# EAGLE design v1 (EAGLE 7.6.0)
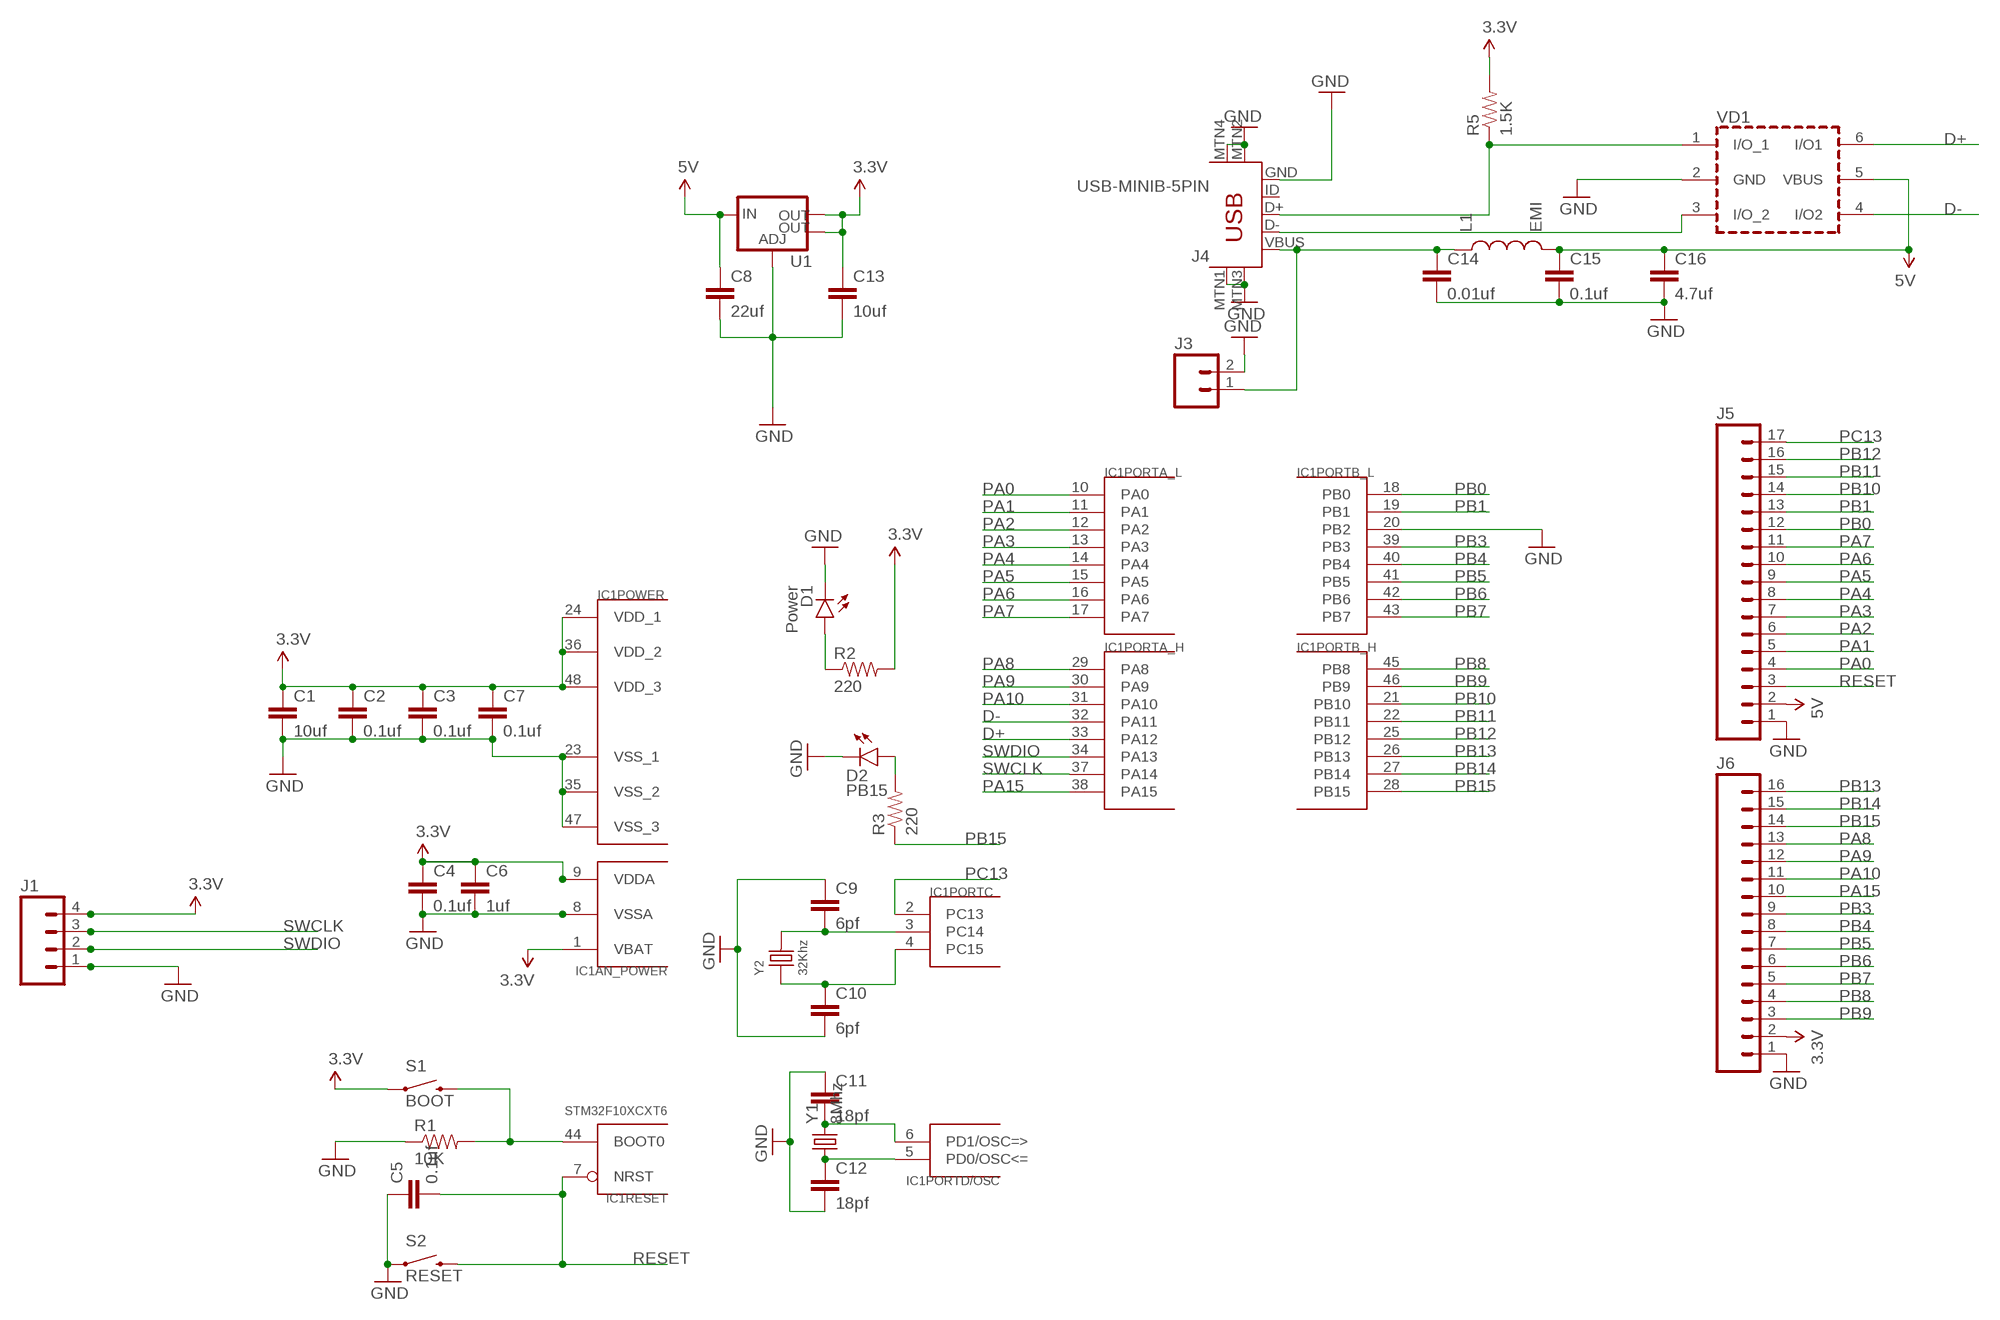
[diagram p0: schematic, sheet 1]

## Parts
C1  10uf  CAP0805  [0805]
C2  0.1uf  CAP0805  [0805]
C3  0.1uf  CAP0805  [0805]
C4  0.1uf  CAP0805  [0805]
C5  0.1uf  CAP0805  [0805]
C6  1uf  CAP0805  [0805]
C7  0.1uf  CAP0805  [0805]
C8  22uf  CAP0805  [0805]
C9  6pf  CAP0805  [0805]
C10  6pf  CAP0805  [0805]
C11  18pf  CAP0805  [0805]
C12  18pf  CAP0805  [0805]
C13  10uf  CAP0805  [0805]
C14  0.01uf  CAP0805  [0805]
C15  0.1uf  CAP0805  [0805]
C16  4.7uf  CAP0805  [0805]
D1  Power  LED1206  [LED-1206]
D2  PB15  LED1206  [LED-1206]
IC1  STM32F10XCXT6  [TQFP48]
J1  M04NO_SILK_ALL_ROUND  [1X04_NO_SILK_ALL_ROUND]
J3  M021X02_NO_SILK  [1X02_NO_SILK]
J4  USB-MINIB-5PIN  [USB-MINIB]
J5  M17NOSILK  [1X17_NO_SILK]
J6  M161X16_NO_SILK  [1X16_NO_SILK]
L1  EMI  INDUCTOR0805  [0805]
R1  10K  RESISTOR0805-RES  [0805]
R2  220  RESISTOR0805-RES  [0805]
R3  220  RESISTOR0805-RES  [0805]
R5  1.5K  RESISTOR0805-RES  [0805]
S1  BOOT  SWITCH-MOMENTARY-2SMD-1101NE  [TACTILE-SWITCH-1101NE]
S2  RESET  SWITCH-MOMENTARY-2SMD-1101NE  [TACTILE-SWITCH-1101NE]
U1  V_REG_LM1117SOT223  [SOT223]
VD1  USBLC6-2SC6  [SOT-23-6L]
Y1  8Mhz  CRYSTALCRYSTAL-SMD-5X3-16MHZ  [CRYSTAL-SMD-5X3]
Y2  32Khz  CRYSTAL-3215  [X2-SMD-3.2X1.5X0.55MM]

## Nets
3.3V: C1.1 C2.1 C3.1 C4.1 C6.1 C7.1 C13.1 IC1.1(AN_POWER:VBAT) IC1.9(AN_POWER:VDDA) IC1.24(POWER:VDD_1) IC1.36(POWER:VDD_2) IC1.48(POWER:VDD_3) J1.4 J6.2 R2.2 R5.2 S1.1 U1.2(OUT) U1.4(OUT)
5V: C8.1 C15.1 C16.1 J5.2 L1.2 U1.3(IN) VD1.5(VBUS)
D+: IC1.33(PORTA_H:PA12) VD1.6(I/O1)
D-: IC1.32(PORTA_H:PA11) VD1.4(I/O2)
GND: C1.2 C2.2 C3.2 C4.2 C5.1 C6.2 C7.2 C8.2 C9.1 C10.2 C11.1 C12.2 C13.2 C14.2 C15.2 C16.2 D1.C D2.C IC1.8(AN_POWER:VSSA) IC1.20(PORTB_L:PB2) IC1.23(POWER:VSS_1) IC1.35(POWER:VSS_2) IC1.47(POWER:VSS_3) J1.1 J3.2 J4.GND J4.MTN1(MTN2) J4.MTN2(MTN3) J4.MTN3(MTN1) J4.MTN4 J5.1 J6.1 R1.1 S2.1 U1.1(ADJ) VD1.2(GND)
N$2: D1.A R2.1
N$4: IC1.44(RESET:BOOT0) R1.2 S1.2
N$5: C11.2 IC1.6(PORTD/OSC:PD1/OSC=>) Y1.3
N$6: C12.1 IC1.5(PORTD/OSC:PD0/OSC<=) Y1.1
N$8: C9.2 IC1.3(PORTC:PC14) Y2.2
N$9: D2.A R3.2
N$11: C10.1 IC1.4(PORTC:PC15) Y2.1
N$12: C14.1 J3.1 J4.VBUS L1.1
N$15: J4.D+ R5.1 VD1.1(I/O_1)
N$16: J4.D- VD1.3(I/O_2)
PA0: IC1.10(PORTA_L:PA0) J5.4
PA1: IC1.11(PORTA_L:PA1) J5.5
PA2: IC1.12(PORTA_L:PA2) J5.6
PA3: IC1.13(PORTA_L:PA3) J5.7
PA4: IC1.14(PORTA_L:PA4) J5.8
PA5: IC1.15(PORTA_L:PA5) J5.9
PA6: IC1.16(PORTA_L:PA6) J5.10
PA7: IC1.17(PORTA_L:PA7) J5.11
PA8: IC1.29(PORTA_H:PA8) J6.13
PA9: IC1.30(PORTA_H:PA9) J6.12
PA10: IC1.31(PORTA_H:PA10) J6.11
PA15: IC1.38(PORTA_H:PA15) J6.10
PB0: IC1.18(PORTB_L:PB0) J5.12
PB1: IC1.19(PORTB_L:PB1) J5.13
PB3: IC1.39(PORTB_L:PB3) J6.9
PB4: IC1.40(PORTB_L:PB4) J6.8
PB5: IC1.41(PORTB_L:PB5) J6.7
PB6: IC1.42(PORTB_L:PB6) J6.6
PB7: IC1.43(PORTB_L:PB7) J6.5
PB8: IC1.45(PORTB_H:PB8) J6.4
PB9: IC1.46(PORTB_H:PB9) J6.3
PB10: IC1.21(PORTB_H:PB10) J5.14
PB11: IC1.22(PORTB_H:PB11) J5.15
PB12: IC1.25(PORTB_H:PB12) J5.16
PB13: IC1.26(PORTB_H:PB13) J6.16
PB14: IC1.27(PORTB_H:PB14) J6.15
PB15: IC1.28(PORTB_H:PB15) J6.14 R3.1
PC13: IC1.2(PORTC:PC13) J5.17
RESET: C5.2 IC1.7(RESET:NRST) J5.3 S2.2
SWCLK: IC1.37(PORTA_H:PA14) J1.3
SWDIO: IC1.34(PORTA_H:PA13) J1.2
Unconnected: J4.ID

## Library data of the parts
C1-C16 = SparkFun-Capacitors:CAP: Capacitor Standard 0603 ceramic capacitor, and 0.1" leaded capacitor.
D1 D2 = SparkFun-LED:LED: LEDs Standard schematic elements and footprints for 5mm, 3mm, 1206, and 0603 sized LEDs. 5mm - Spark Fun Electronics SKU : COM-00529 (and others)
IC1 = stm32:STM32F10XCXT6: ST STM32F101/103 48pin LQFP
J1 = SparkFun-Connectors:M04: Header 4 Standard 4-pin 0.1" header. Use with straight break away headers (SKU : PRT-00116), right angle break away headers (PRT-00553), swiss pins (PRT-00743), machine pins (PRT-00117), and female headers (PRT-00115). Molex polarized connector foot print use with SKU : PRT-08231 with associated crimp pins and housings. 1MM SMD Version SKU: PRT-10208; PROD_ID: CONN-09696
J3 = SparkFun-Connectors:M02: Standard 2-pin 0.1" header. Use with - straight break away headers ( PRT-00116) - right angle break away headers (PRT-00553) - swiss pins (PRT-00743) - machine pins (PRT-00117) - female headers (PRT-00115) Molex polarized connector foot print use with: PRT-08233 with associated crimp pins and housings. 2.54_SCREWTERM for use with PRT-10571. 3.5mm Screw Terminal footprints for PRT-08084 5mm Screw Terminal footprints for use with PRT-08432
J4 = SparkFun-Connectors:USB-MINIB: Mini-USB "B" connector with 5th pin broken out. Created new symbol breaking out 5th "ID" pin in mini/micro USB connector spec. See: http://en.wikipedia.org/wiki/Mini_usb#Cables. Uses same footprint as 4-pin symbol. Also added pins to connect to mounting / shield pads if required (probably not generally needed as signals aren't shielded once they leave the connector).; PROD_ID: CONN-08193
J5 = SparkFun-Connectors:M17: 1x17 .1" header
J6 = SparkFun-Connectors:M16: 1x16 .1" header
L1 = SparkFun-Passives:INDUCTOR: Inductors Basic Inductor/Choke - 0603 and 1206. Footprints are not proven and vary greatly between part numbers. INDUCTOR POWER 3.3UH 4.0A SMD 0.197" L x 0.197" W x 0.177" H (5.00mm x 5.00mm x 4.50mm)
R1-R3 R5 = SparkFun-Resistors:RESISTOR: Resistor Basic schematic elements and footprints for 0603, 1206, and PTH resistors.
S1 S2 = SparkFun-Electromechanical:SWITCH-MOMENTARY-2: Various NO switches- pushbuttons, reed, etc; PROD_ID: SWCH-00815
U1 = SparkFun-PowerIC:V_REG_LM1117: Voltage Regulator LM1117 Standard adjustable voltage regulator but in SMD form. Spark Fun Electronics SKU : COM-00595; PROD_ID: VREG-08170
VD1 = usblc6:USBLC6-2: VERY LOW CAPACITANCE ESD PROTECTION 2 line Datasheet link <http://www.st.com/web/catalog/sense_power/FM114/CL1137/SC1489/PF93353>
Y1 = SparkFun-FreqCtrl:CRYSTAL: Various standard crystals. Proven footprints.; PROD_ID: XTAL-08218
Y2 = Seeed-OPL-crystal-osctllator:CRYSTAL

## Board
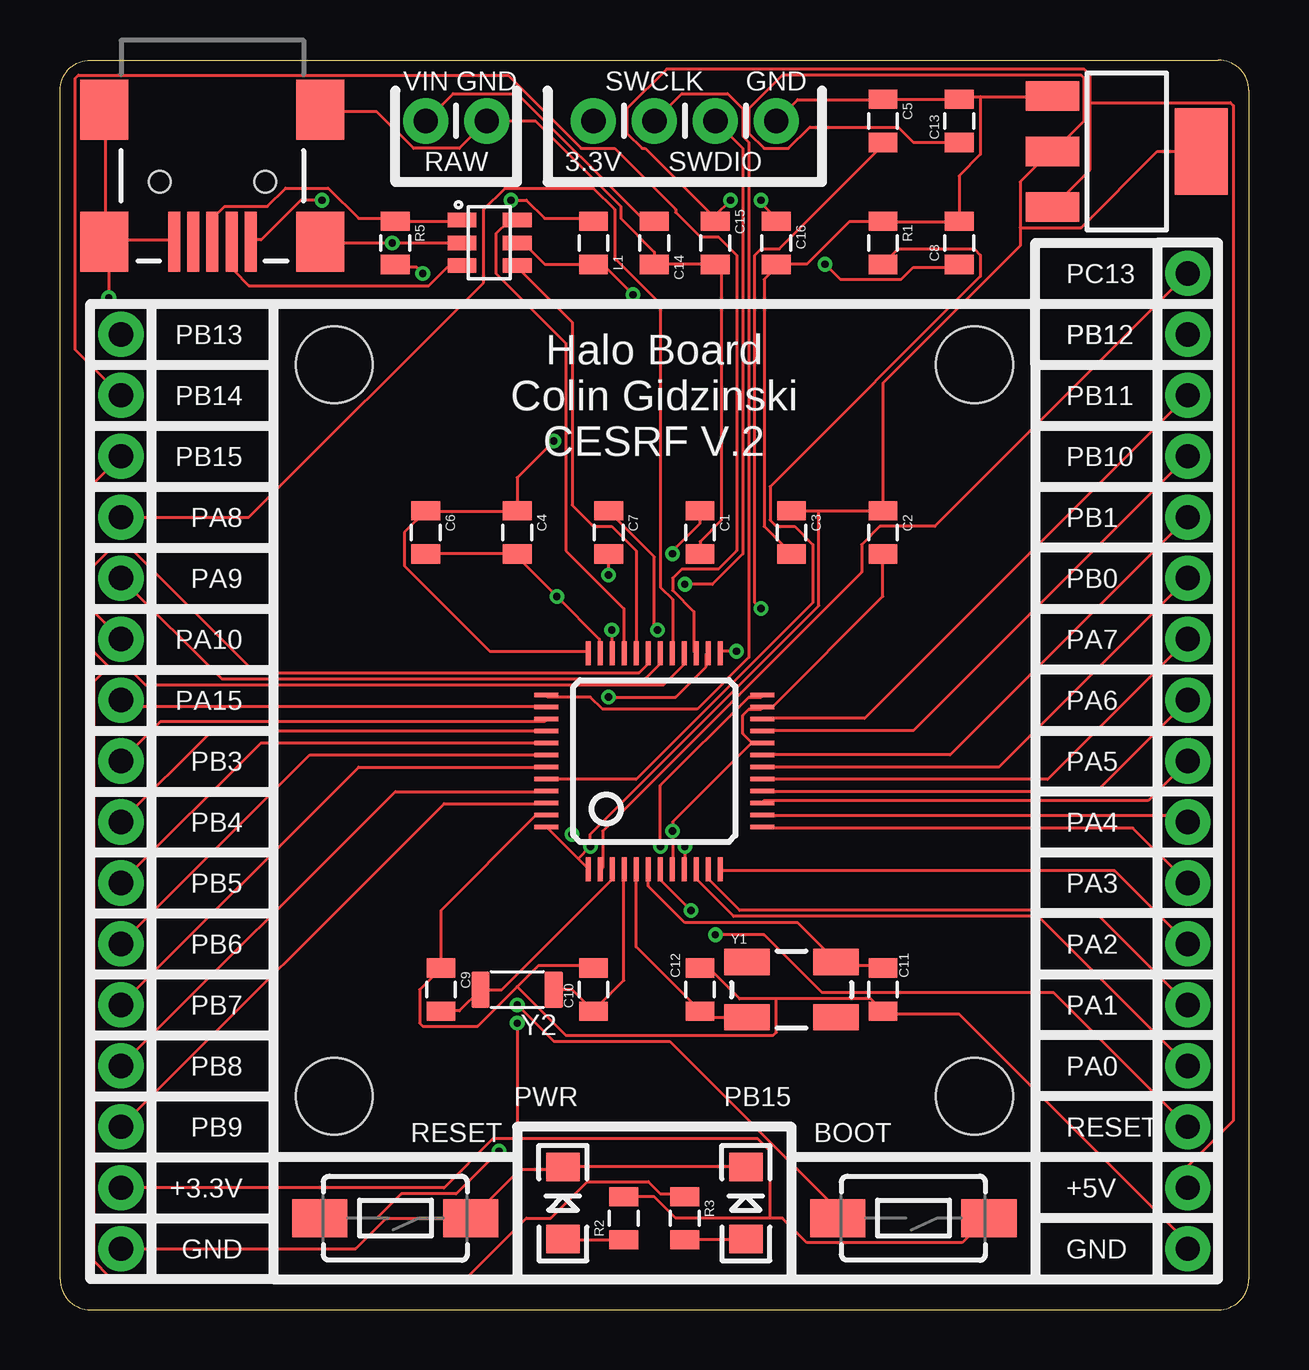
[diagram p1: board, top side]
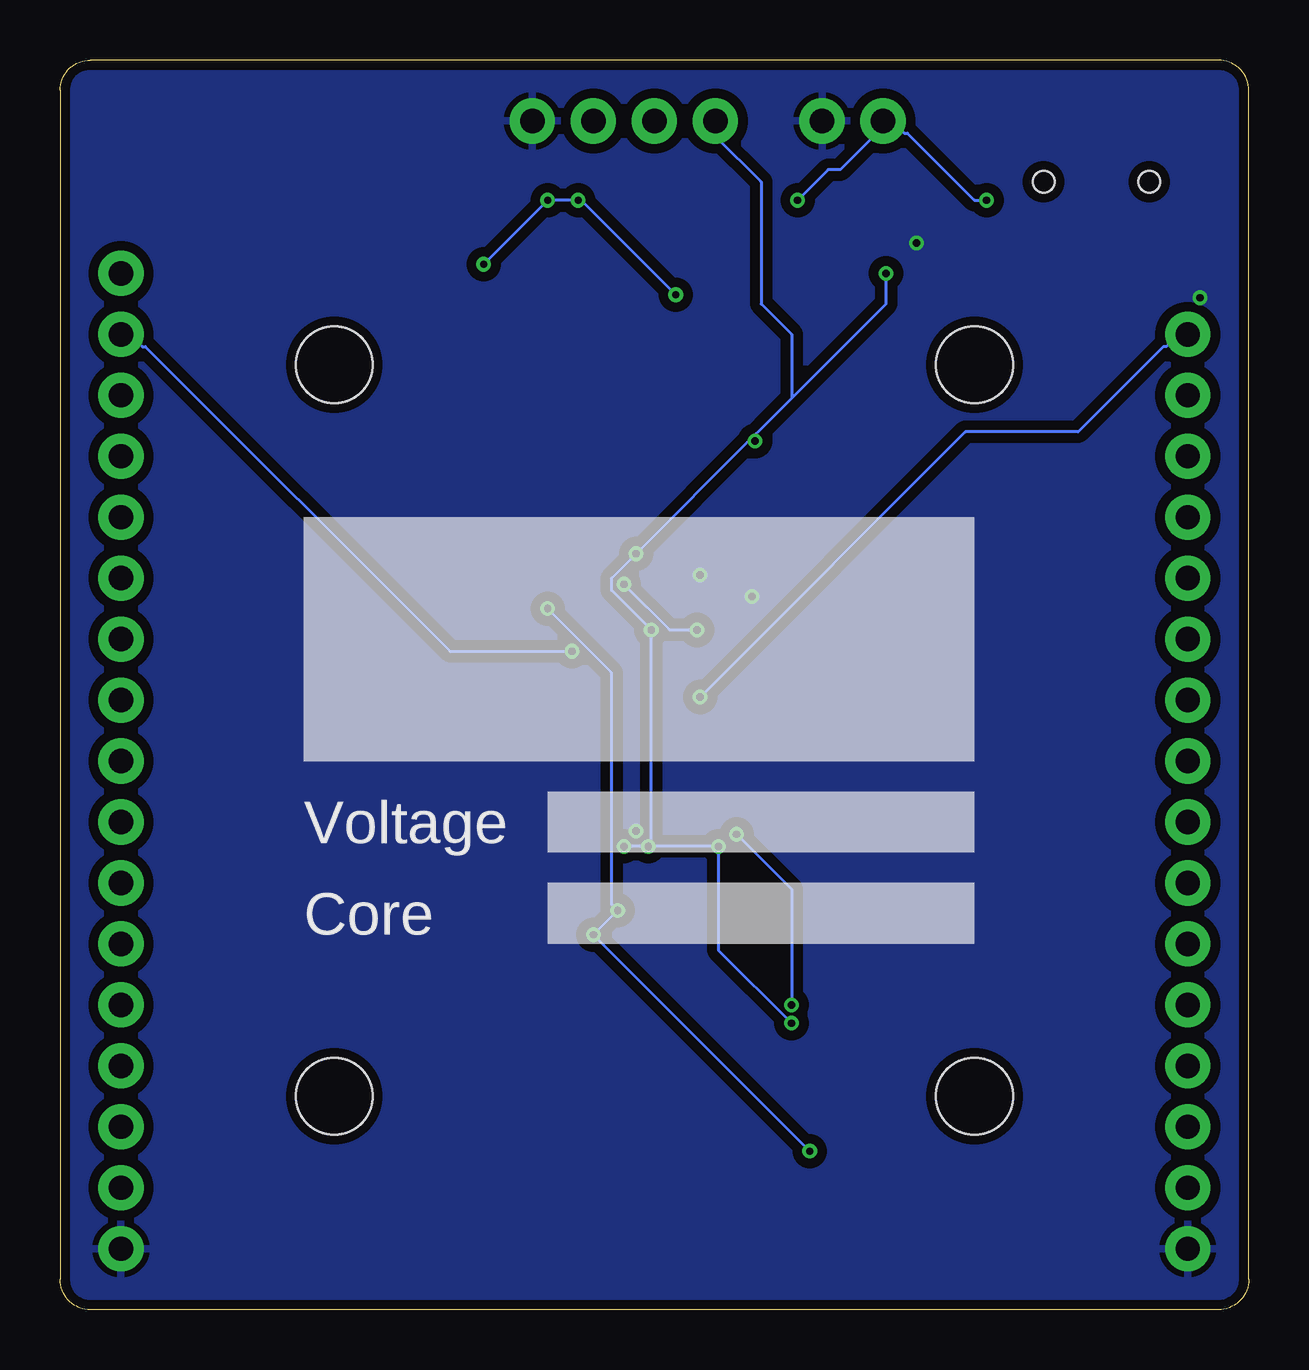
[diagram p2: board, bottom side, seen from below]

Size 49.53 x 52.07 mm. Coordinates in mm from the lower left corner, seen from the top.
Outline: 1.27,52.07 48.26,52.07 arc-90 49.53,50.8 49.53,1.27 arc-90 48.26,0 1.27,0 arc-90 0,1.27 0,50.8 arc-90 1.27,52.07
Copper layers (1*16): Top 0.035mm / dielectric 1.5mm / Bottom 0.035mm
Design rules "dirt_cheap_dirty_boards.v1": minimum track width 5mil, minimum drill 12mil, track to track 5mil, track to pad 5mil, pad to pad 5mil, via to via 5mil, smd to smd 0mil, copper to edge 10mil, drill to drill 10mil, minimum pad ring 10mil, minimum via ring 6mil, stop-mask expansion 2mil, vias tented up to drill 25mil, thermal gap 10mil
Holes 3.2 mm at 11.43,8.89 38.1,8.89 38.1,39.37 11.43,39.37

### Footprints (pad centres in the part's own frame; a part is rotated, then mirrored left to right if it is on the bottom)
0805 = smd 0.8 x 1.2: 1 -0.9,0; 2 0.9,0
LED-1206 = smd 1.2 x 1.4: A -1.5,0; C 1.5,0
TQFP48 = smd 0.2 x 1: 1 -2.75,-4.5; 2 -2.25,-4.5; 3 -1.75,-4.5; 4 -1.25,-4.5; 5 -0.75,-4.5; 6 -0.25,-4.5; 7 0.25,-4.5; 8 0.75,-4.5; 9 1.25,-4.5; 10 1.75,-4.5; 11 2.25,-4.5; 12 2.75,-4.5; 25 2.75,4.5; 26 2.25,4.5; 27 1.75,4.5; 28 1.25,4.5; 29 0.75,4.5; 30 0.25,4.5; 31 -0.25,4.5; 32 -0.75,4.5; 33 -1.25,4.5; 34 -1.75,4.5; 35 -2.25,4.5; 36 -2.75,4.5 | smd 1 x 0.2: 13 4.5,-2.75; 14 4.5,-2.25; 15 4.5,-1.75; 16 4.5,-1.25; 17 4.5,-0.75; 18 4.5,-0.25; 19 4.5,0.25; 20 4.5,0.75; 21 4.5,1.25; 22 4.5,1.75; 23 4.5,2.25; 24 4.5,2.75; 37 -4.5,2.75; 38 -4.5,2.25; 39 -4.5,1.75; 40 -4.5,1.25; 41 -4.5,0.75; 42 -4.5,0.25; 43 -4.5,-0.25; 44 -4.5,-0.75; 45 -4.5,-1.25; 46 -4.5,-1.75; 47 -4.5,-2.25; 48 -4.5,-2.75
1X04_NO_SILK_ALL_ROUND = drill 1.016 pad 1.88: 1 0,0; 2 2.54,0; 3 5.08,0; 4 7.62,0
1X02_NO_SILK = drill 1.016 pad 1.88: 1 0,0; 2 2.54,0
USB-MINIB = smd 2.5 x 0.5: D+ 2.5,0; D- 2.5,0.8; GND 2.5,-1.6; ID 2.5,-0.8; VBUS 2.5,1.6 | smd 2.5 x 2: MTN1 -3,4.5; MTN2 2.5,4.5; MTN3 -3,-4.5; MTN4 2.5,-4.5 | hole 0.9: 0,2.2; 0,-2.2
1X17_NO_SILK = drill 1.016 pad 1.88: 1 0,0; 2 2.54,0; 3 5.08,0; 4 7.62,0; 5 10.16,0; 6 12.7,0; 7 15.24,0; 8 17.78,0; 9 20.32,0; 10 22.86,0; 11 25.4,0; 12 27.94,0; 13 30.48,0; 14 33.02,0; 15 35.56,0; 16 38.1,0; 17 40.64,0
1X16_NO_SILK = drill 1.016 pad 1.88: 1 0,0; 2 2.54,0; 3 5.08,0; 4 7.62,0; 5 10.16,0; 6 12.7,0; 7 15.24,0; 8 17.78,0; 9 20.32,0; 10 22.86,0; 11 25.4,0; 12 27.94,0; 13 30.48,0; 14 33.02,0; 15 35.56,0; 16 38.1,0
TACTILE-SWITCH-1101NE = smd 2.3 x 1.6: 1 -3.15,0; 2 3.15,0
SOT223 = smd 1.219 x 2.235: 1 -2.311,-3.099; 2 0,-3.099; 3 2.311,-3.099 | smd 3.6 x 2.2: 4 0,3.099
SOT-23-6L = smd 0.6 x 1.2: 1 -0.95,-2.3; 2 0,-2.3; 3 0.95,-2.3; 4 0.95,0; 5 0,0; 6 -0.95,0
CRYSTAL-SMD-5X3 = smd 1.9 x 1.1: 1 -1.85,-1.15; 2 1.85,-1.15; 3 1.85,1.15; 4 -1.85,1.15
X2-SMD-3.2X1.5X0.55MM = smd 0.762 x 1.524: 1 -1.524,0; 2 1.524,0

### Placement (x,y rotation side)
C1  26.67,32.39 270 top
C2  34.29,32.39 270 top
C3  30.48,32.39 270 top
C4  19.05,32.39 270 top
C5  34.29,49.53 270 top
C6  15.24,32.39 270 top
C7  22.86,32.39 270 top
C8  37.47,44.45 90 top
C9  15.88,13.34 270 top
C10  22.23,13.34 90 top
C11  34.29,13.34 90 top
C12  26.67,13.34 90 top
C13  37.47,49.53 90 top
C14  24.77,44.45 270 top
C15  27.3,44.45 270 top
C16  29.84,44.45 270 top
D1  20.96,4.45 90 top
D2  28.58,4.45 90 top
IC1  24.77,22.86 0 top
J1  29.84,49.53 180 top
J3  15.24,49.53 0 top
J4  6.35,46.99 270 top
J5  46.99,2.54 90 top
J6  2.54,2.54 90 top
L1  22.23,44.45 270 top
R1  34.29,44.45 270 top
R2  23.5,3.81 90 top
R3  26.04,3.81 270 top
R5  13.97,44.45 270 top
S1  35.56,3.81 180 top
S2  13.97,3.81 180 top
U1  44.45,48.26 270 top
VD1  19.05,44.45 270 top
Y1  30.48,13.34 0 top
Y2  19.05,13.34 180 top

### Tracks (layer width: path | path; a pad name or v marks a point on that pad's centre or on a via)
3.3V  (via drill 0.3)
  Top 0.127: 29.59,3.81 30.1,3.81 31.12,2.79 37.59,2.79 38.61,3.81 S1.1 | 29.59,3.81 25.65,3.81 24.77,4.7 23.5,4.7 R2.2 | J6.2 16,5.08 18.03,7.11 19.05,7.11 | 19.05,7.11 29.08,7.11 29.59,6.6 29.59,3.81 | 31.62,33.27 34.29,33.27 C2.1 34.29,38.61 40,44.32 40,45.08 | 31.62,33.27 30.48,33.27 C3.1 | C13.1 37.47,48.64 35.56,48.64 34.92,49.28 31.24,49.28 30.35,48.39 29.34,48.39 28.7,49.02 28.7,50.04 30.1,51.44 42.55,51.44 42.67,51.31 42.67,49.53 41.4,48.26 U1.2 41.27,48.26 40,46.99 40,45.08 | U1.4 45.72,48.26 42.55,45.08 40,45.08 | 15.24,33.27 14.35,32.39 14.35,30.99 17.91,27.43 21.97,27.43 IC1.36 | 15.24,33.27 19.05,33.27 C4.1 19.05,34.67 v20.57,36.19 | 15.24,33.27 C6.1 | 21.59,18.8 21.97,18.41 IC1.1 | 21.59,18.8 20.32,20.07 IC1.48 | v26.04,19.3 26.04,18.41 IC1.9 | 21.59,18.8 v22.1,19.3 22.1,19.81 31.62,29.34 31.62,33.27 | v25.02,19.3 25.02,21.84 28.7,25.53 29.21,25.53 IC1.24 | v24.89,28.32 24.77,28.45 24.77,31.37 22.86,33.27 C7.1 | C1.1 26.67,32.77 25.53,31.62 v25.53,31.5 | v15.11,43.18 14.86,43.43 13.97,43.43 R5.2 | v19.05,11.94 19.05,7.11
  Bottom 0.127: 24.89,19.3 v22.1,19.3 22.1,14.99 v19.05,11.94 | v26.04,19.3 v25.02,19.3 24.89,19.3 | 24.89,19.3 v24.89,28.32 26.54,29.97 26.54,30.48 v25.53,31.5 20.7,36.32 | v15.11,43.18 15.11,41.91 19.05,37.97 | 20.7,36.32 20.26,36.77 19.05,37.97 | 20.7,36.32 v20.57,36.19 | J1.4 22.23,48.89 20.32,46.99 20.32,41.91 19.05,40.64 19.05,37.97
5V  (via drill 0.3)
  Top 0.127: VD1.5 19.3,44.45 20.19,43.56 22.23,43.56 L1.2 22.23,43.43 22.73,43.43 v23.88,42.29 | 27.18,45.59 24.38,48.39 24.26,48.39 23.62,49.02 23.62,50.04 25.27,51.69 42.67,51.69 42.93,51.44 42.93,50.29 | 27.18,45.59 27.3,45.47 C15.1 27.18,45.59 | 42.93,50.29 42.93,47.5 41.4,45.97 U1.3 | v29.21,46.23 29.21,46.1 29.84,45.47 C16.1 | v27.94,46.23 27.3,45.59 27.18,45.59 | v31.88,43.56 32.51,42.93 35.05,42.93 35.56,43.43 37.47,43.43 C8.1 | J5.2 46.99,5.97 48.89,7.87 48.89,50.17 48.77,50.29 42.93,50.29
  Bottom 0.127: v31.88,43.56 v29.21,46.23 v27.94,46.23 27.81,46.23 v23.88,42.29
D+
  Top 0.127: IC1.33 23.5,27.43 23.5,29.21 21.08,31.62 21.08,40.26 18.16,43.18 18.16,44.83 18.67,45.34 19.05,45.34 VD1.6
D-
  Top 0.127: IC1.32 24,27.43 24,31.62 22.99,32.64 22.23,32.64 21.34,33.53 21.34,41.15 19.05,43.43 VD1.4
GND  (via drill 0.3)
  Top 0.127: 29.84,12.95 33.78,12.95 C11.1 34.29,12.32 37.47,12.32 46.99,2.79 J5.1 | 29.84,12.95 28.32,12.95 27.05,14.22 C12.2 | IC1.47 20.19,20.57 19.81,20.57 15.88,16.64 C9.1 14.99,13.34 14.99,11.94 15.11,11.81 17.4,11.81 19.05,13.46 | 19.05,13.46 19.94,14.35 22.23,14.35 C10.2 | 29.84,12.95 29.84,11.56 29.72,11.43 21.08,11.43 19.05,13.46 | 28.83,23.62 25.53,20.32 v25.53,19.94 25.53,18.41 IC1.8 | 28.83,23.62 29.21,23.62 IC1.20 28.83,23.62 | 28.83,23.62 28.45,24 28.45,24.77 28.7,25.02 29.21,25.02 IC1.23 29.34,25.15 29.72,25.15 34.29,29.72 C2.2 | 34.29,45.34 32.89,45.34 31.12,43.56 29.84,43.56 C16.2 29.84,43.43 29.34,42.93 29.34,32.64 C3.2 | 34.29,45.34 37.47,45.34 C8.2 37.47,47.24 38.35,48.13 38.35,50.55 | 34.29,45.34 R1.1 | D2.C 28.58,5.97 20.96,5.97 D1.C 20.96,5.84 19.18,5.84 17.14,3.81 S2.1 13.59,3.81 12.32,2.54 J6.1 | C1.2 26.67,32 27.56,32.89 27.56,43.18 27.3,43.43 C15.2 27.3,43.56 24.77,43.56 | IC1.35 22.48,27.43 22.48,27.94 v20.7,29.72 19.05,31.37 C4.2 C6.2 | 34.29,50.42 37.47,50.42 C13.2 37.47,50.55 38.35,50.55 | 38.35,50.55 41.27,50.55 U1.1 | VD1.2 v13.84,44.45 10.92,44.45 J4.MTN2 | v22.86,30.61 C7.2 | v2.03,42.16 2.03,44.32 1.91,44.45 J4.MTN4 1.91,44.58 | 1.91,44.58 4.7,44.58 J4.GND | 1.91,44.58 1.91,49.91 J4.MTN3 | J4.MTN1 10.92,49.91 13.21,49.91 14.73,48.39 16.64,48.39 J3.2 19.81,49.53 23.37,45.97 23.37,45.47 24.77,44.07 24.77,43.56 | 34.29,50.42 30.73,50.42 J1.1 | 34.29,50.42 C5.1 | 24.77,43.56 C14.2
  pour Bottom (isolate 0.406, rank 2): 0,52.07 49.53,52.07 49.53,0 0,0
N$2
  Top 0.127: R2.1 20.96,2.92 D1.A
N$4  (via drill 0.3)
  Top 0.127: 21.34,22.1 24,22.1 31.37,29.46 31.37,31.88 30.61,32.64 29.84,32.64 29.59,32.89 29.59,34.29 38.35,43.05 38.35,43.94 38.1,44.2 34.92,44.2 34.29,43.56 R1.2 | 21.34,22.1 20.32,22.1 IC1.44 | v19.05,12.7 20.57,11.18 25.4,11.18 32.38,4.19 32.38,3.81 S1.2 | 21.34,22.1 v21.34,19.81
  Bottom 0.127: v19.05,12.7 19.05,17.53 v21.34,19.81
N$5
  Top 0.127: IC1.6 24.51,18.29 24.51,17.65 26.04,16.13 30.73,16.13 32.26,14.6 Y1.3 32.38,14.48 32.51,14.35 34.29,14.35 C11.2
N$6
  Top 0.127: IC1.5 24,18.29 24,15.11 C12.1 26.67,12.32 26.8,12.19 28.58,12.19 Y1.1
N$8
  Top 0.127: IC1.3 22.99,18.29 22.99,17.91 18.41,13.34 Y2.2 16.64,12.45 C9.2
N$9
  Top 0.127: R3.2 28.58,2.92 D2.A
N$11
  Top 0.127: C10.1 23.5,13.72 23.5,18.29 IC1.4 | Y2.1 21.34,13.34 C10.1 | C10.1
N$12  (via drill 0.3)
  Top 0.127: v18.8,46.23 19.43,46.23 20.19,45.47 22.23,45.47 L1.1 | J3.1 16.38,50.67 19.05,50.67 24.26,45.47 24.77,45.47 C14.1 | v10.92,46.23 10.03,46.23 8.38,44.58 8,44.58 J4.VBUS
  Bottom 0.127: v18.8,46.23 17.53,47.5 17.02,47.5 15.24,49.28 | v10.92,46.23 11.43,46.23 14.22,49.02 14.35,49.02 14.61,49.28 15.24,49.28 | 15.24,49.28 J3.1
N$15
  Top 0.127: VD1.1 16.64,45.34 13.97,45.34 R5.1 13.97,45.47 12.45,45.47 11.18,46.74 9.4,46.74 8.64,45.97 6.86,45.97 6.35,45.47 J4.D+
N$16
  Top 0.127: VD1.3 16.64,43.43 16.13,43.43 15.37,42.67 7.87,42.67 7.24,43.31 7.24,44.45 J4.D-
PA0
  Top 0.127: J5.4 40.77,16.38 28.07,16.38 26.54,17.91 26.54,18.29 IC1.10
PA1
  Top 0.127: J5.5 43.05,16.64 28.32,16.64 27.05,17.91 27.05,18.29 IC1.11
PA2
  Top 0.127: J5.6 43.94,18.29 27.56,18.29 IC1.12
PA3
  Top 0.127: J5.7 44.7,20.07 29.34,20.07 IC1.13
PA4
  Top 0.127: J5.8 46.74,20.57 29.34,20.57 IC1.14
PA5
  Top 0.127: J5.9 45.34,21.21 29.34,21.21 IC1.15
PA6
  Top 0.127: J5.10 43.18,21.59 29.34,21.59 IC1.16
PA7
  Top 0.127: J5.11 41.15,22.1 29.34,22.1 IC1.17
PA8
  Top 0.127: J6.13 7.87,33.02 17.65,42.8 17.65,45.85 18.54,46.74 22.23,46.74 23.11,45.85 23.11,43.81 25.02,41.91 25.02,30.1 25.53,29.59 25.53,27.43 IC1.29
PA9
  Top 0.127: J6.12 6.73,26.29 24.38,26.29 25.02,26.92 25.02,27.3 IC1.30
PA10
  Top 0.127: J6.11 1.4,29.08 1.4,30.99 2.03,31.62 3.05,31.62 8.13,26.54 24.13,26.54 24.51,26.92 24.51,27.3 IC1.31
PA15
  Top 0.127: J6.10 2.79,25.15 20.19,25.15 IC1.38
PB0
  Top 0.127: J5.12 39.12,22.61 29.34,22.61 IC1.18
PB1
  Top 0.127: J5.13 37.08,23.11 29.34,23.11 IC1.19
PB3
  Top 0.127: J6.9 4.19,24.51 20.19,24.51 IC1.39
PB4
  Top 0.127: J6.8 6.35,24.13 20.19,24.13 IC1.40
PB5
  Top 0.127: J6.7 8.38,23.62 20.19,23.62 IC1.41
PB6
  Top 0.127: J6.6 10.41,23.11 20.19,23.11 IC1.42
PB7
  Top 0.127: J6.5 12.45,22.61 20.19,22.61 IC1.43
PB8
  Top 0.127: J6.4 13.97,21.59 20.19,21.59 IC1.45
PB9
  Top 0.127: J6.3 16,21.08 20.19,21.08 IC1.46
PB10
  Top 0.127: J5.14 35.56,24.13 29.34,24.13 IC1.21
PB11
  Top 0.127: J5.15 33.53,24.64 29.34,24.64 IC1.22
PB12  (via drill 0.3)
  Top 0.127: v28.19,27.43 27.56,27.43 IC1.25
  Bottom 0.127: v28.19,27.43 33.27,27.43 45.97,40.13 46.1,40.13 46.61,40.64 J5.16
PB13  (via drill 0.3)
  Top 0.127: v22.86,25.53 25.65,25.53 26.92,26.8 26.92,27.3 IC1.26
  Bottom 0.127: v22.86,25.53 11.81,36.58 7.11,36.58 3.56,40.13 3.43,40.13 2.92,40.64 J6.16
PB14
  Top 0.127: J6.15 0.64,40 0.64,51.31 0.76,51.44 18.67,51.44 21.72,48.39 23.11,48.39 25.65,45.85 25.65,45.72 26.67,44.7 27.43,44.7 28.19,43.94 28.19,31.62 27.43,30.86 25.91,30.86 25.53,30.48 25.53,29.97 26.42,29.08 26.42,27.43 IC1.27
PB15
  Top 0.127: 2.03,26.8 2.79,26.8 3.56,26.03 25.15,26.03 26.04,26.92 26.04,27.3 IC1.28 | 2.03,26.8 1.14,27.69 1.14,34.16 J6.14 | 2.03,26.8 1.4,26.16 1.4,2.03 2.03,1.4 17.02,1.4 19.43,3.81 20.45,3.81 21.97,5.33 24.51,5.33 25.02,4.83 26.04,4.83 R3.1
PC13
  Top 0.127: J5.17 36.45,32.64 34.16,32.64 33.4,31.88 33.4,30.73 22.61,19.94 22.61,18.41 IC1.2
RESET  (via drill 0.3)
  Top 0.127: v26.29,16.64 25.02,17.91 25.02,18.29 IC1.7 | v27.3,15.62 29.34,15.62 31.75,13.21 41.4,13.21 J5.3 | v29.21,29.21 28.96,29.46 28.96,43.94 29.21,44.2 29.97,44.2 34.29,48.51 C5.2 | S2.2 13.21,3.81 14.22,4.83 16.51,4.83 v18.29,6.6
  Bottom 0.127: v29.21,29.21 26.54,26.54 26.54,16.89 v26.29,16.64 v27.3,15.62 v18.29,6.6
SWCLK
  Top 0.127: J1.3 25.91,50.67 27.81,50.67 28.45,50.04 28.45,48.89 28.7,48.64 28.7,27.18 26.54,25.02 22.61,25.02 22.1,25.53 20.32,25.53 IC1.37
SWDIO  (via drill 0.3)
  Top 0.127: v22.99,28.32 22.99,27.43 IC1.34 | v26.04,30.23 27.18,30.23 28.45,31.5 28.45,48.39 J1.2
  Bottom 0.127: v22.99,28.32 24.13,28.32 v26.04,30.23

### Text on the board
tNames: VIN | GND | SWCLK | GND | RAW | 3.3V | SWDIO | PC13 | PB13 | PB1 | PB12 | PB14 | PB11 | PB15 | Halo Board / Colin Gidzinski / CESRF V.2 | PB10 | PA8 | PB1 | PA9 | PB0 | PA10 | PA7 | PA15 | PA6 | PB3 | PA5 | PB4 | PA4 | PB5 | PA3 | PB6 | PA2 | PB7 | PA1 | PB8 | PA0 | PWR | PB15 | PB9 | RESET | BOOT | RESET | +3.3V | +5V | GND | GND
bNames: Voltage | Core